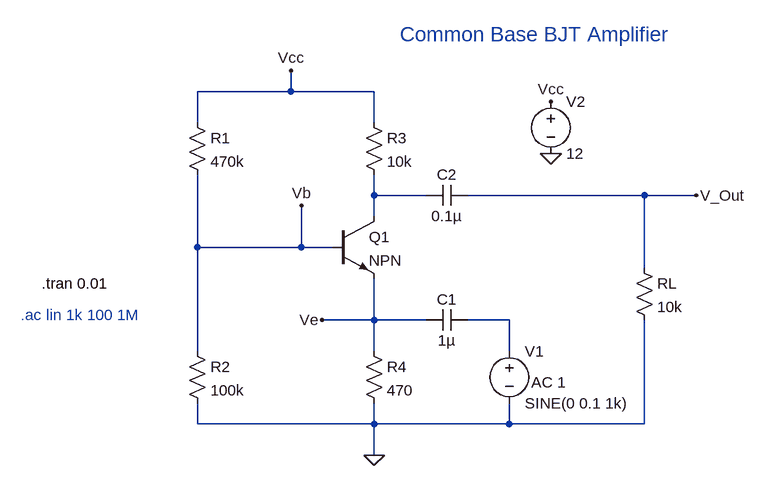
[diagram p0: schematic Common_Base_Amplifier.asc]
Common_Base_Amplifier.asc, the LTspice schematic file:
Version 4.1
SHEET 1 880 680
WIRE 0 -96 0 -128
WIRE 0 -96 -144 -96
WIRE 128 -96 0 -96
WIRE -144 -48 -144 -96
WIRE 128 -48 128 -96
WIRE 128 64 128 32
WIRE 208 64 128 64
WIRE 544 64 272 64
WIRE 624 64 544 64
WIRE 128 96 128 64
WIRE -144 144 -144 32
WIRE 16 144 16 80
WIRE 16 144 -144 144
WIRE 64 144 16 144
WIRE 544 176 544 64
WIRE 128 256 128 192
WIRE 128 256 48 256
WIRE 208 256 128 256
WIRE 336 256 272 256
WIRE -144 304 -144 144
WIRE 128 304 128 256
WIRE 336 304 336 256
WIRE -144 416 -144 384
WIRE 128 416 128 384
WIRE 128 416 -144 416
WIRE 336 416 336 384
WIRE 336 416 128 416
WIRE 544 416 544 256
WIRE 544 416 336 416
WIRE 128 464 128 416
FLAG 128 464 0
FLAG 400 0 0
FLAG 400 -80 Vcc
FLAG 0 -128 Vcc
FLAG 624 64 V_Out
FLAG 16 80 Vb
FLAG 48 256 Ve
SYMBOL npn 64 96 R0
SYMATTR InstName Q1
SYMBOL voltage 336 288 R0
WINDOW 123 34 64 Left 2
WINDOW 39 0 0 Left 0
SYMATTR Value2 AC 1
SYMATTR InstName V1
SYMATTR Value SINE(0 0.1 1k)
SYMBOL cap 272 240 R90
WINDOW 0 0 32 VBottom 2
WINDOW 3 32 32 VTop 2
SYMATTR InstName C1
SYMATTR Value 1µ
SYMBOL res 112 288 R0
SYMATTR InstName R4
SYMATTR Value 470
SYMBOL res -160 288 R0
SYMATTR InstName R2
SYMATTR Value 100k
SYMBOL res -160 -64 R0
SYMATTR InstName R1
SYMATTR Value 470k
SYMBOL res 112 -64 R0
SYMATTR InstName R3
SYMATTR Value 10k
SYMBOL voltage 400 -96 R0
WINDOW 123 0 0 Left 0
WINDOW 39 0 0 Left 0
SYMATTR InstName V2
SYMATTR Value 12
SYMBOL cap 272 48 R90
WINDOW 0 0 32 VBottom 2
WINDOW 3 32 32 VTop 2
SYMATTR InstName C2
SYMATTR Value 0.1µ
SYMBOL res 528 160 R0
SYMATTR InstName RL
SYMATTR Value 10k
TEXT -416 248 Left 2 ;.ac lin 1k 100 1M
TEXT -384 200 Left 2 !.tran 0.01
TEXT 168 -184 Left 3 ;Common Base BJT Amplifier

The netlist it stands for:
* Common_Base_Amplifier.asc
Q1 N001 Vb Ve 0 NPN
V1 N002 0 SINE(0 0.1 1k) AC 1
C1 N002 Ve 1µ
R4 Ve 0 470
R2 Vb 0 100k
R1 Vcc Vb 470k
R3 Vcc N001 10k
V2 Vcc 0 12
C2 V_Out N001 0.1µ
RL V_Out 0 10k
.model NPN NPN
.model PNP PNP
.lib standard.bjt
* .ac lin 1k 100 1M
.tran 0.01
* Common Base BJT Amplifier
.backanno
.end